# Altium project PROC114E3_SCH.PrjPcb (part 13 of 22)

## Sheet 27.SchDoc
size 513 x 386 mm
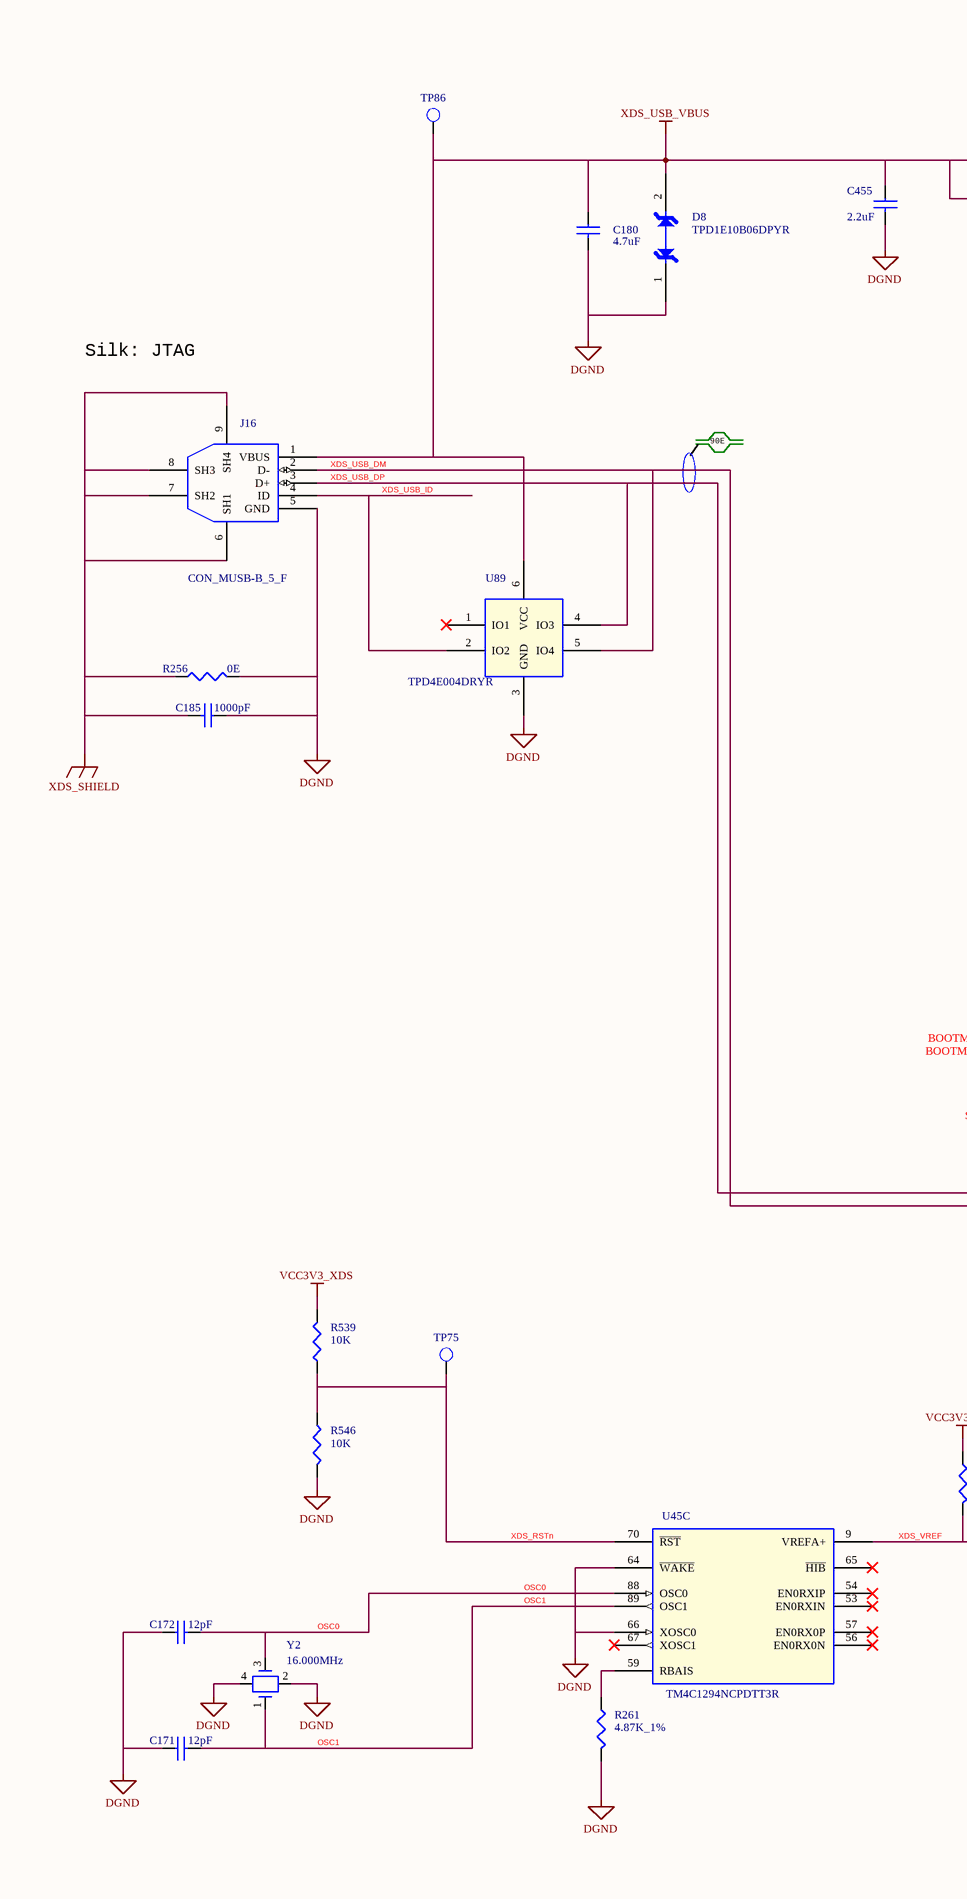
[diagram p43: 27.SchDoc, left]
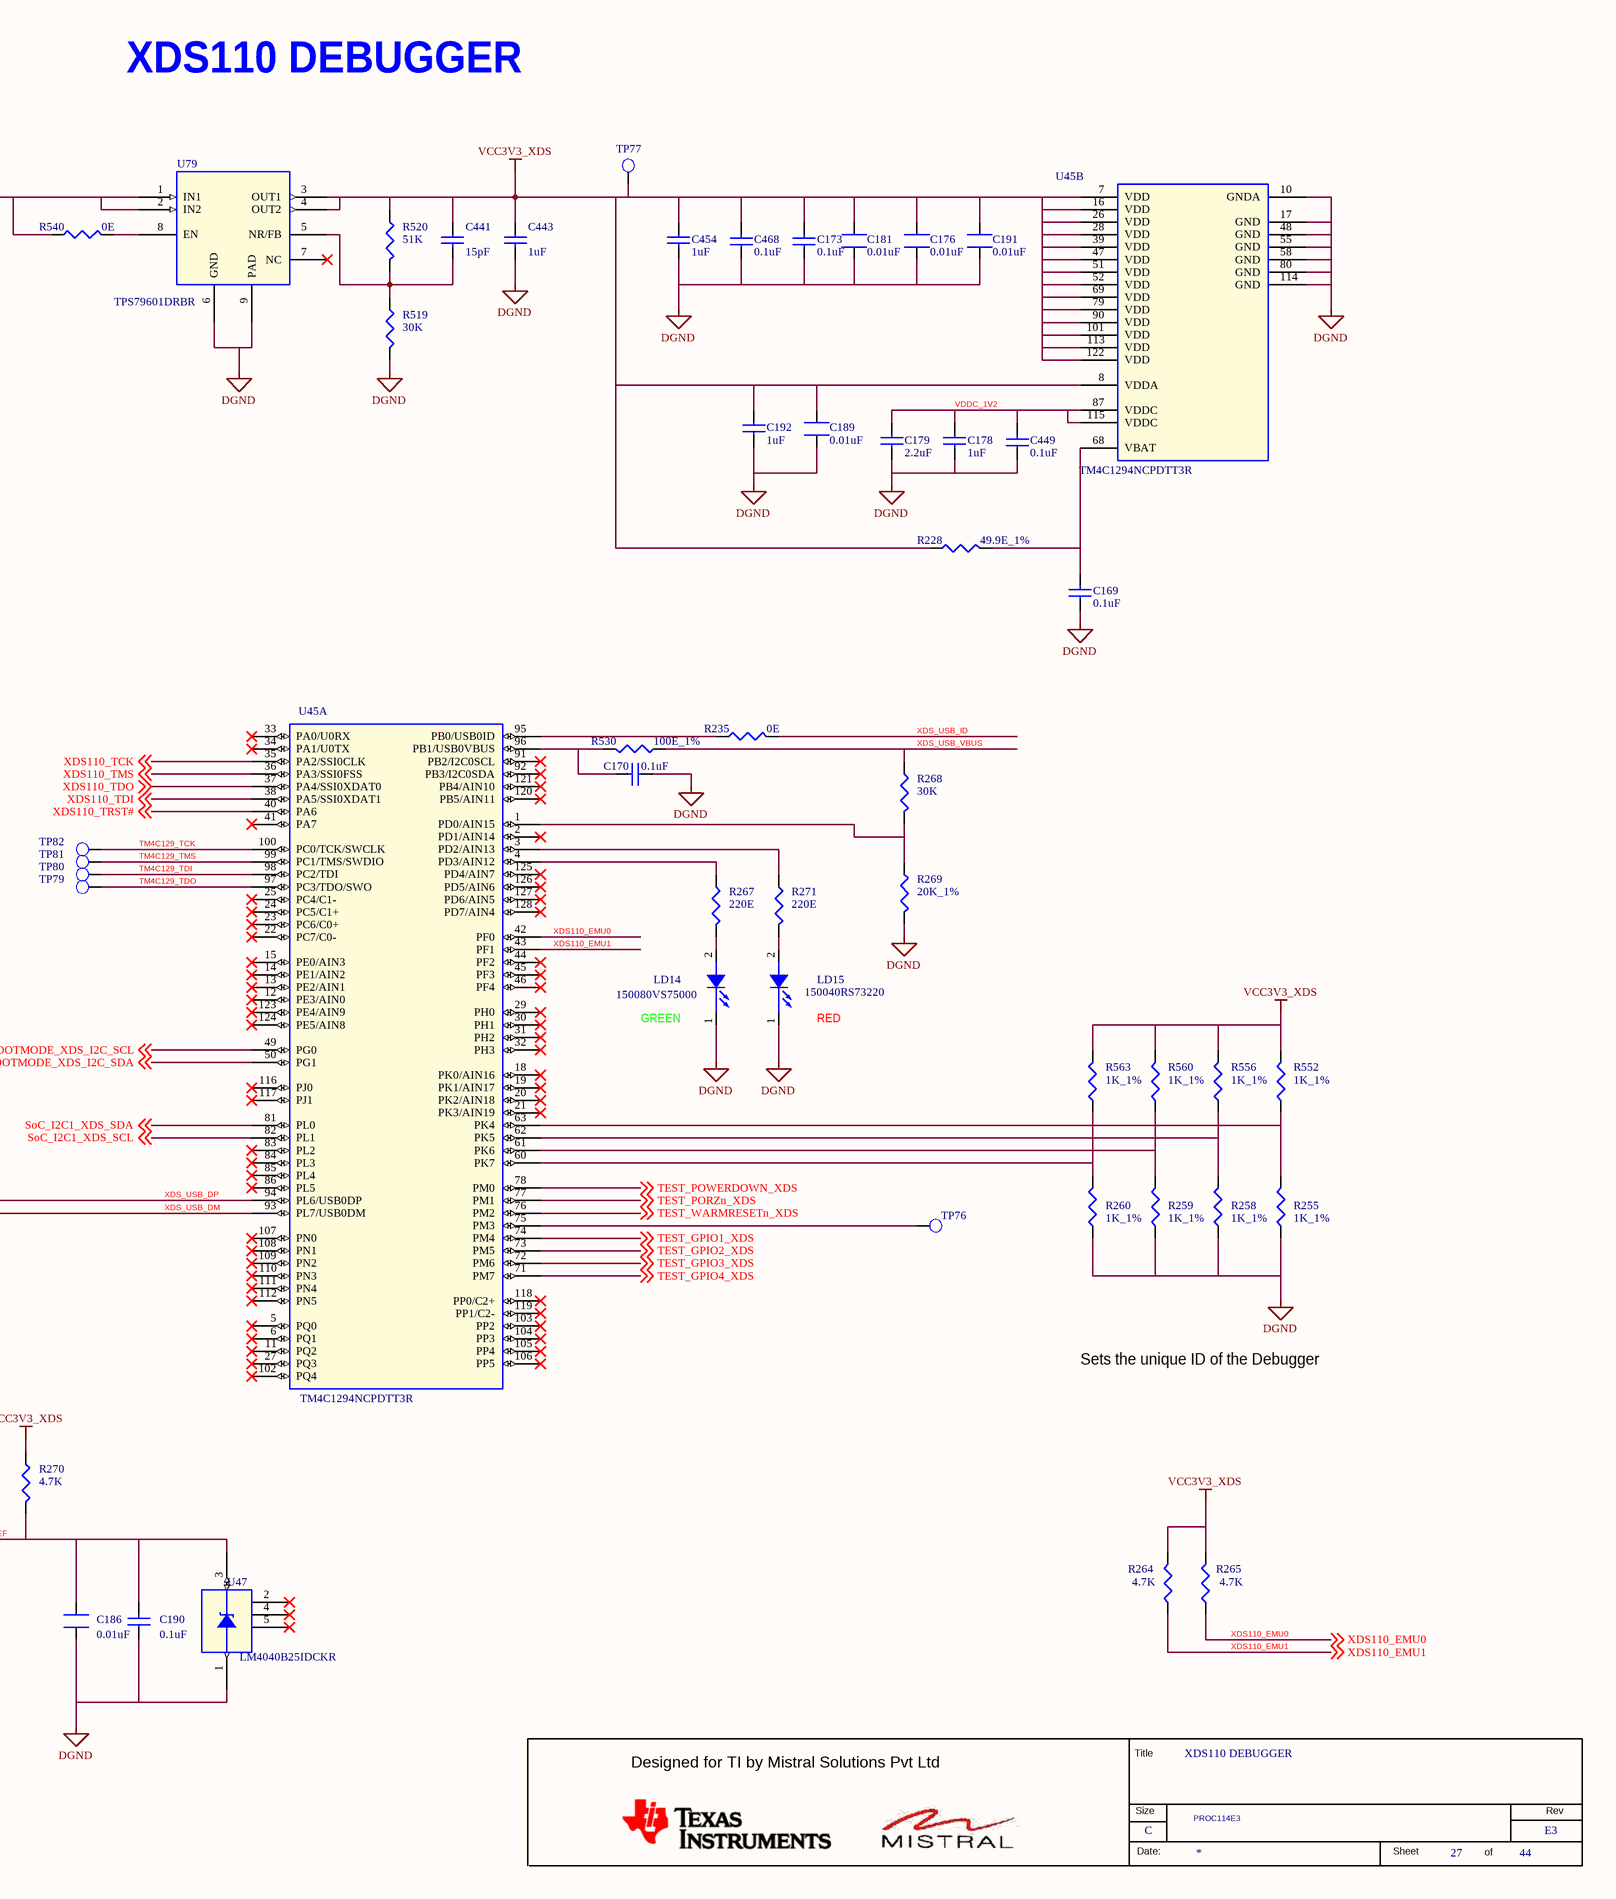
[diagram p44: 27.SchDoc, right]

### Parts
(Parts that share a designator on the sheet are numbered #1, #2 ... from top to bottom, then left to right.)
*#27  RevCode: E3  Title: XDS110 DEBUGGER  Page Size: C  Page Number: 27  Page Count: 44  Variant Name: PROC114E3  (hidden comment: MISTRAL_TITLEBLK_CSIZE)  (graphical)
C169  0.1uF  [CAP0201_0-5]
C170  0.1uF  [CAP0201_0-5]
C171  12pF  [CAP0201_0-5]
C172  12pF  [CAP0201_0-5]
C173  0.1uF  [CAP0201_0-5]
C176  0.01uF  [CAP0402N]
C178  1uF  [CAP0201_0-5]
C179  2.2uF  [CAP0402_0-75]
C180  4.7uF  [CAP0402_0-75]
C181  0.01uF  [CAP0402N]
C185  1000pF  [CAP1206_1-75]
C186  0.01uF  [CAP0402N]
C189  0.01uF  [CAP0402N]
C190  0.1uF  [CAP0201_0-5]
C191  0.01uF  [CAP0402N]
C192  1uF  [CAP0201_0-5]
C441  15pF  [CAP0201_0-5]
C443  1uF  [CAP0201_0-5]
C449  0.1uF  [CAP0201_0-5]
C454  1uF  [CAP0201_0-5]
C455  2.2uF  [CAP0402_0-75]
C468  0.1uF  [CAP0201_0-5]
D8  TPD1E10B06DPYR  [DIO_DFN0402_0-5]
J16  CON_MUSB-B_5_F  [CON_MUSBB5_629105150521_S_R_S_2-7]
LD14  150080VS75000  [LED_150080VS75000_80X50_SMD_0-8]
LD15  150040RS73220  [LED_150040GS73220_40X20_SMD_0-4]
R228  49.9E_1%  [RES0402_0-5]
R235  0E  [RES0402_0-5]
R255  1K_1%  [RES0402_0-5]
R256  0E  [RES0603_0-75]
R258  1K_1%  [RES0402_0-5]
R259  1K_1%  [RES0402_0-5]
R260  1K_1%  [RES0402_0-5]
R261  4.87K_1%  [RES0402]
R264  4.7K  [RES0201_0-5]
R265  4.7K  [RES0201_0-5]
R267  220E  [RES0402_0-5]
R268  30K  [RES0402_0-5]
R269  20K_1%  [RES0402_0-5]
R270  4.7K  [RES0201_0-5]
R271  220E  [RES0402_0-5]
R519  30K  [RES0402_0-5]
R520  51K  [RES0402_0-5]
R530  100E_1%  [RES0402_0-5]
R539  10K  [RES0201_0-5]
R540  0E  [RES0201_0-5]
R546  10K  [RES0201_0-5]
R552  1K_1%  [RES0402_0-5]
R556  1K_1%  [RES0402_0-5]
R560  1K_1%  [RES0402_0-5]
R563  1K_1%  [RES0402_0-5]
TP75  TP20_SMD  [TP20_SMD]  (value not drawn)
TP76  TP20_SMD  [TP20_SMD]  (value not drawn)
TP77  TP20_SMD  [TP20_SMD]  (value not drawn)
TP79  TP20_SMD  [TP20_SMD]  (value not drawn)
TP80  TP20_SMD  [TP20_SMD]  (value not drawn)
TP81  TP20_SMD  [TP20_SMD]  (value not drawn)
TP82  TP20_SMD  [TP20_SMD]  (value not drawn)
TP86  TP20_SMD  [TP20_SMD]  (value not drawn)
U45  TM4C1294NCPDTT3R  [TQFP128_15-74_550X550_1-2]  (parts A,B,C of 3)
U47  LM4040B25IDCKR  [SC70-5_1-1]
U79  TPS79601DRBR  [SON8_25-59_130X130_1]
U89  TPD4E004DRYR  [SON6_19-68_40X60_PB_0-6]
Y2  16.000MHz  [XTAL4_XRCGB-FM_80X60_SMD_0-7]

### Nets
DGND: C169.1 C170.1 C171.1 C172.1 C173.1 C176.2 C178.2 C179.2 C180.2 C181.2 C185.1 C186.2 C189.2 C190.1 C191.2 C192.2 C443.2 C449.1 C454.2 C455.2 C468.1 D8.1 J16.5(GND) LD14.1(CATHODE) LD15.1(CATHODE) R255.1 R256.1 R258.1 R259.1 R260.1 R261.2 R269.2 R519.2 R546.2 U45.10(GNDA) U45.17(GND) U45.48(GND) U45.55(GND) U45.58(GND) U45.64(~{WAKE}) U45.66(XOSC0) U45.80(GND) U45.114(GND) U47.1(ANODE) U79.6(GND) U79.9(PAD) U89.3(GND) Y2.2 Y2.4
VCC3V3_XDS: C173.2 C176.1 C181.1 C189.1 C191.1 C192.1 C441.1 C443.1 C454.1 C468.2 R228.2 R264.1 R265.1 R270.1 R520.1 R539.2 R552.2 R556.2 R560.2 R563.2 TP77.1(TP) U45.7(VDD) U45.8(VDDA) U45.16(VDD) U45.26(VDD) U45.28(VDD) U45.39(VDD) U45.47(VDD) U45.51(VDD) U45.52(VDD) U45.69(VDD) U45.79(VDD) U45.90(VDD) U45.101(VDD) U45.113(VDD) U45.122(VDD) U79.3(OUT1) U79.4(OUT2)
XDS_SHIELD: C185.2 J16.6(SH1) J16.7(SH2) J16.8(SH3) J16.9(SH4) R256.2
XDS_USB_VBUS: C180.1 C455.1 D8.2 J16.1(VBUS) R268.1 R530.1 R540.1 TP86.1(TP) U79.1(IN1) U79.2(IN2) U89.6(VCC)
BOOTMODE_XDS_I2C_SCL: U45.49(PG0) ; off-sheet BOOTMODE_XDS_I2C_SCL
BOOTMODE_XDS_I2C_SDA: U45.50(PG1) ; off-sheet BOOTMODE_XDS_I2C_SDA
OSC0: C172.2 U45.88(OSC0) Y2.3
OSC1: C171.2 U45.89(OSC1) Y2.1
SoC_I2C1_XDS_SCL: U45.82(PL1) ; off-sheet SoC_I2C1_XDS_SCL
SoC_I2C1_XDS_SDA: U45.81(PL0) ; off-sheet SoC_I2C1_XDS_SDA
TEST_GPIO1_XDS: U45.74(PM4) ; off-sheet TEST_GPIO1_XDS
TEST_GPIO2_XDS: U45.73(PM5) ; off-sheet TEST_GPIO2_XDS
TEST_GPIO3_XDS: U45.72(PM6) ; off-sheet TEST_GPIO3_XDS
TEST_GPIO4_XDS: U45.71(PM7) ; off-sheet TEST_GPIO4_XDS
TEST_PORZn_XDS: U45.77(PM1) ; off-sheet TEST_PORZn_XDS
TEST_POWERDOWN_XDS: U45.78(PM0) ; off-sheet TEST_POWERDOWN_XDS
TEST_WARMRESETn_XDS: U45.76(PM2) ; off-sheet TEST_WARMRESETn_XDS
TM4C129_TCK: TP82.1(TP) U45.100(PC0/TCK/SWCLK)
TM4C129_TDI: TP80.1(TP) U45.98(PC2/TDI)
TM4C129_TDO: TP79.1(TP) U45.97(PC3/TDO/SWO)
TM4C129_TMS: TP81.1(TP) U45.99(PC1/TMS/SWDIO)
VDDC_1V2: C178.1 C179.1 C449.2 U45.87(VDDC) U45.115(VDDC)
XDS110_EMU0: R265.2 U45.42(PF0) ; off-sheet XDS110_EMU0
XDS110_EMU1: R264.2 U45.43(PF1) ; off-sheet XDS110_EMU1
XDS110_TCK: U45.35(PA2/SSI0CLK) ; off-sheet XDS110_TCK
XDS110_TDI: U45.38(PA5/SSI0XDAT1) ; off-sheet XDS110_TDI
XDS110_TDO: U45.37(PA4/SSI0XDAT0) ; off-sheet XDS110_TDO
XDS110_TMS: U45.36(PA3/SSI0FSS) ; off-sheet XDS110_TMS
XDS110_TRST#: U45.40(PA6) ; off-sheet XDS110_TRST#
XDS_RSTn: R539.1 R546.1 TP75.1(TP) U45.70(~{RST})
XDS_USB_DM: J16.2(D-) U45.93(PL7/USB0DM) U89.5(IO4)
XDS_USB_DP: J16.3(D+) U45.94(PL6/USB0DP) U89.4(IO3)
XDS_USB_ID: J16.4(ID) R235.2 U89.2(IO2)
XDS_VREF: C186.1 C190.2 R270.2 U45.9(VREFA+) U47.3(CATHODE)
NetC169_2: C169.2 R228.1 U45.68(VBAT)
NetC170_2: C170.2 R530.2 U45.96(PB1/USB0VBUS)
NetC441_2: C441.2 R519.1 R520.2 U79.5(NR/FB)
NetLD14_2: LD14.2(ANODE) R267.2
NetLD15_2: LD15.2(ANODE) R271.2
NetR235_1: R235.1 U45.95(PB0/USB0ID)
NetR255_2: R255.2 R552.1 U45.63(PK4)
NetR258_2: R258.2 R556.1 U45.62(PK5)
NetR259_2: R259.2 R560.1 U45.61(PK6)
NetR260_2: R260.2 R563.1 U45.60(PK7)
NetR261_1: R261.1 U45.59(RBAIS)
NetR267_1: R267.1 U45.4(PD3/AIN12)
NetR268_2: R268.2 R269.1 U45.1(PD0/AIN15)
NetR271_1: R271.1 U45.3(PD2/AIN13)
NetR540_2: R540.2 U79.8(EN)
NetTP76_1: TP76.1(TP) U45.75(PM3)

Not connected (* = marked no-connect by the designer): U45 2(PD1/AIN14)* 5(PQ0)* 6(PQ1)* 11(PQ2)* 12(PE3/AIN0)* 13(PE2/AIN1)* 14(PE1/AIN2)* 15(PE0/AIN3)* 18(PK0/AIN16)* 19(PK1/AIN17)* 20(PK2/AIN18)* 21(PK3/AIN19)* 22(PC7/C0-)* 23(PC6/C0+)* 24(PC5/C1+)* 25(PC4/C1-)* 27(PQ3)* 29(PH0)* 30(PH1)* 31(PH2)* 32(PH3)* 33(PA0/U0RX)* 34(PA1/U0TX)* 41(PA7)* 44(PF2)* 45(PF3)* 46(PF4)* 53(EN0RXIN)* 54(EN0RXIP)* 56(EN0RX0N)* 57(EN0RX0P)* 65(~{HIB})* 67(XOSC1)* 83(PL2)* 84(PL3)* 85(PL4)* 86(PL5)* 91(PB2/I2C0SCL)* 92(PB3/I2C0SDA)* 102(PQ4)* 103(PP2)* 104(PP3)* 105(PP4)* 106(PP5)* 107(PN0)* 108(PN1)* 109(PN2)* 110(PN3)* 111(PN4)* 112(PN5)* 116(PJ0)* 117(PJ1)* 118(PP0/C2+)* 119(PP1/C2-)* 120(PB5/AIN11)* 121(PB4/AIN10)* 123(PE4/AIN9)* 124(PE5/AIN8)* 125(PD4/AIN7)* 126(PD5/AIN6)* 127(PD6/AIN5)* 128(PD7/AIN4)*; U47 2(NC1)* 4(NC2)* 5(NC3)*; U79 7(NC)*; U89 1(IO1)*

### Notes on the sheet
- XDS110 DEBUGGER
- Silk: JTAG
- 90E
- (near LD14) GREEN
- (near LD15) RED
- Sets the unique ID of the Debugger
- (in symbol MISTRAL_TITLEBLK_CSIZE) Title; Designed for TI by Mistral Solutions Pvt Ltd; Size; Rev; Date:; Sheet; of

### Library data of the parts
*#27 = MISTRAL_TITLEBLK_CSIZE: Issue: 1.0; Page Create Date: March  8, 1995; Page Modify Date: *; Schematic Page Count: 44; Schematic Page Number: 27
C169 C170 C173 C190 C449 = CAP_Dup2: as C474 on sheet 25; PCB Footprint: CAP0201_0-5; Footprint Path: Y:\MIS_DATABASE\Library\ALTIUM_TOOL\PCB_FOOTPRINTS\Altium_Footprint_Lib.PcbLib; Library Path: Y:\MIS_DATABASE\Library\ALTIUM_TOOL\SCHEMATICS_PARTS\MS_DISCRETE_Library.schlib; Footprint Ref: CAP0201_0-5; Library Ref: CAP; MECHANICAL 3D STEP FILE: CAP0201_0-5; Chkd/date: MANIRAJA/230118; Crtd /date: MANIRAJA/230118; Datasheet: Y:\MIS_DATABASE\DATASHEETS\CAPACITORS\GRM033R61C104KE14.PDF; Temperature: -55°C+85°C; Weight: 0.33mg; Height: 0.33MM; Distributor_part_number: 490-14305-1-ND; Distributor_name: DIGIKEY; Package: 0201; Voltage: 16V; Tolerance: 10%
C171 = CAP_Dup2: CAP CERAMIC 12pF 25V 5% C0G(NP0) 0201; Part_type: CAPACITORS\CERAMIC; Mfr_part_number: GRM0335C1E120JA01D; Mfr_name: MURATA; Mistral Part No: 120009030213-R; Custom_Duty: 15%; Customs_HS_Code: 85322990; Wattage: NA; Project: QCS610_NANOSOM; PCB Footprint: CAP0201_0-5; Footprint Path: Y:\MIS_DATABASE\Library\ALTIUM_TOOL\PCB_FOOTPRINTS\Altium_Footprint_Lib.PcbLib; Library Path: Y:\MIS_DATABASE\Library\ALTIUM_TOOL\SCHEMATICS_PARTS\MS_DISCRETE_Library.schlib; MECHANICAL 3D STEP FILE: CAP0201_0-5; Chkd/date: MANIRAJA/020620; Crtd /date: ALVY/300520; Datasheet: Y:\MIS_DATABASE\DATASHEETS\CAPACITORS\GRM0335C1E120JA01.PDF; Temperature: -55°C+125°C; Weight: 0.33mg; Height: 0.33MM; Library Ref: CAP; Distributor_part_number: 490-3144-1-ND; Distributor_name: DIGIKEY; Package: 0201; Voltage: 25V; Tolerance: 5%; Footprint Ref: CAP0201_0-5
C172 = CAP_Dup2: CAP CERAMIC 12pF 25V 5% C0G(NP0) 0201; Mistral Part No: 120009030213-R; Mfr_name: MURATA; Mfr_part_number: GRM0335C1E120JA01D; Part_type: CAPACITORS\CERAMIC; Project: QCS610_NANOSOM; Wattage: NA; Customs_HS_Code: 85322990; Custom_Duty: 15%; PCB Footprint: CAP0201_0-5; Footprint Ref: CAP0201_0-5; Tolerance: 5%; Voltage: 25V; Package: 0201; Distributor_name: DIGIKEY; Distributor_part_number: 490-3144-1-ND; Library Ref: CAP; Height: 0.33MM; Weight: 0.33mg; Temperature: -55°C+125°C; Datasheet: Y:\MIS_DATABASE\DATASHEETS\CAPACITORS\GRM0335C1E120JA01.PDF; Crtd /date: ALVY/300520; Chkd/date: MANIRAJA/020620; MECHANICAL 3D STEP FILE: CAP0201_0-5; Library Path: Y:\MIS_DATABASE\Library\ALTIUM_TOOL\SCHEMATICS_PARTS\MS_DISCRETE_Library.schlib; Footprint Path: Y:\MIS_DATABASE\Library\ALTIUM_TOOL\PCB_FOOTPRINTS\Altium_Footprint_Lib.PcbLib
C176 C186 C189 C191 = CAP_Dup3: CAP CERAMIC 0.01uF 25V 10% X5R 0201; Mistral Part No: 120018010007-R; Mfr_name: MURATA; Mfr_part_number: GRM033R61E103KA12J; Part_type: CAPACITORS\CERAMIC; PCB Footprint: CAP0201_0-5; Project: TI_MAXIE_CPB; Customs_HS_Code: 85322990; Custom_Duty: 15%; Wattage: NA; Library Ref: CAP; Tolerance: 10%; Voltage: 25V; Package: 0201; Distributor_name: DIGIKEY; Distributor_part_number: GRM033R61E103KA12J-ND; Height: 0.33MM; Datasheet: Y:\MIS_DATABASE\DATASHEETS\CAPACITORS\GRM033R61E103KA12.PDF; Crtd /date: MANIRAJA/230118; Chkd/date: MANIRAJA/230118; Weight: 0.33mg; Temperature: -55°C+85°C; MECHANICAL 3D STEP FILE: CAP0201_0-5; Footprint Ref: CAP0201_0-5; Library Path: Y:\MIS_DATABASE\Library\ALTIUM_TOOL\SCHEMATICS_PARTS\MS_DISCRETE_Library.schlib; Footprint Path: Y:\MIS_DATABASE\Library\ALTIUM_TOOL\PCB_FOOTPRINTS\Altium_Footprint_Lib.PcbLib
C178 = CAP_Dup2: CAP CERAMIC 1uF 16V 20% X5R 0201; Part_type: CAPACITORS\CERAMIC; Mfr_part_number: GRM033R61C105ME15D; Mfr_name: MURATA; Mistral Part No: 120018090038-R; Custom_Duty: 15%; Customs_HS_Code: 85322990; Project: QCS610_NANOSOM; Wattage: NA; PCB Footprint: CAP0201_0-5; Chkd/date: MANIRAJA/300520; Crtd /date: ALVY/260520; Datasheet: Y:\MIS_DATABASE\DATASHEETS\CAPACITORS\GRM033R61C105ME15.PDF; Temperature: -55°C+85°C; Weight: 0.33mg; Height: 0.39MM; Distributor_part_number: 490-18654-1-ND; Distributor_name: DIGIKEY; Package: 0201; Voltage: 16V; Tolerance: 20%; MECHANICAL 3D STEP FILE: CAP0201_0-5; Library Path: Y:\MIS_DATABASE\Library\ALTIUM_TOOL\SCHEMATICS_PARTS\MS_DISCRETE_Library.schlib; Footprint Path: Y:\MIS_DATABASE\Library\ALTIUM_TOOL\PCB_FOOTPRINTS\Altium_Footprint_Lib.PcbLib; Library Ref: CAP; Footprint Ref: CAP0201_0-5
C179 = CAP_Dup2: CAP CERAMIC 2.2uF 25V 10% X5R 0402; Part_type: CAPACITORS\CERAMIC; Mfr_part_number: GRM155R61E225KE11D; Mfr_name: MURATA; Mistral Part No: 120015120001-R; Custom_Duty: 15%; Customs_HS_Code: 85322990; Wattage: NA; Project: TI_AM263X_CC; PCB Footprint: CAP0402_0-75; Library Ref: CAP; MECHANICAL 3D STEP FILE: CAP0402_0-75; Chkd/date: ALVY/010721; Crtd /date: MANIRAJA/010721; Datasheet: Y:\MIS_DATABASE\DATASHEETS\CAPACITORS\GRM155R61E225KE11.PDF; Temperature: -55°C+85°C; Weight: 1.5mg; Height: 0.70MM; Distributor_part_number: 490-12703-1-ND; Distributor_name: DIGIKEY; Package: 0402; Voltage: 25V; Tolerance: 10%; Footprint Ref: CAP0402_0-75; Library Path: Y:\MIS_DATABASE\Library\ALTIUM_TOOL\SCHEMATICS_PARTS\MS_DISCRETE_Library.schlib; Footprint Path: Y:\MIS_DATABASE\Library\ALTIUM_TOOL\PCB_FOOTPRINTS\Altium_Footprint_Lib.PcbLib
C180 = CAP_Dup2: CAP CERAMIC 4.7uF 10V 20% X5R 0402; Part_type: CAPACITORS\CERAMIC; Mfr_part_number: GRM155R61A475MEAAD; Mfr_name: MURATA; Mistral Part No: 120012060002-R; Custom_Duty: 15%; Customs_HS_Code: 85322990; Wattage: NA; Project: TI_J7SVB_PCIE_ADD-ON-CARD; PCB Footprint: CAP0402_0-75; Footprint Path: Y:\MIS_DATABASE\Library\ALTIUM_TOOL\PCB_FOOTPRINTS\Altium_Footprint_Lib.PcbLib; Library Path: Y:\MIS_DATABASE\Library\ALTIUM_TOOL\SCHEMATICS_PARTS\MS_DISCRETE_Library.schlib; MECHANICAL 3D STEP FILE: CAP0402_0-75; Chkd/date: MANIRAJA/110718; Crtd /date: ALVY/110718; Datasheet: Y:\MIS_DATABASE\DATASHEETS\CAPACITORS\GRM155R61A475MEAAD.PDF; Temperature: -55°C+85°C; Weight: 14mg; Height: 0.65MM; Library Ref: CAP; Distributor_part_number: 490-14306-1-ND; Distributor_name: DIGIKEY; Package: 0402; Voltage: 10V; Tolerance: 20%; Footprint Ref: CAP0402_0-75
C181 = CAP_Dup3: as C442 on sheet 26; Footprint Path: Y:\MIS_DATABASE\Library\ALTIUM_TOOL\PCB_FOOTPRINTS\Altium_Footprint_Lib.PcbLib; Library Path: Y:\MIS_DATABASE\Library\ALTIUM_TOOL\SCHEMATICS_PARTS\MS_DISCRETE_Library.schlib; Footprint Ref: CAP0201_0-5; MECHANICAL 3D STEP FILE: CAP0201_0-5; Temperature: -55°C+85°C; Weight: 0.33mg; Chkd/date: MANIRAJA/230118; Crtd /date: MANIRAJA/230118; Datasheet: Y:\MIS_DATABASE\DATASHEETS\CAPACITORS\GRM033R61E103KA12.PDF; Height: 0.33MM; Distributor_part_number: GRM033R61E103KA12J-ND; Distributor_name: DIGIKEY; Package: 0201; Voltage: 25V; Tolerance: 10%; Library Ref: CAP
C185 = CAP_Dup2: CAP CERAMIC 1000pF 2KV 10% X7R 1206; Mistral Part No: 120015080006-R; Mfr_name: AVX CORPORATION; Mfr_part_number: 1206GC102KAT1A; Part_type: CAPACITORS\CERAMIC; Project: ADR1B; Customs_HS_Code: 85322990; Custom_Duty: 15%; Wattage: NA; PCB Footprint: CAP1206_1-75; Footprint Path: Y:\MIS_DATABASE\Library\ALTIUM_TOOL\PCB_FOOTPRINTS\Altium_Footprint_Lib.PcbLib; Library Path: Y:\MIS_DATABASE\Library\ALTIUM_TOOL\SCHEMATICS_PARTS\MS_DISCRETE_Library.schlib; Footprint Ref: CAP1206_1-75; Library Ref: CAP; Tolerance: 10%; Voltage: 2KV; Package: 1206; Distributor_name: DIGIKEY; Distributor_part_number: 478-2956-1-ND; Height: 1.52MM; Datasheet: Y:\MIS_DATABASE\DATASHEETS\CAPACITORS\AVX_HV-MLC.PDF; Crtd /date: MAZHAR/281106; Chkd/date: SHREESHAIL/291106; Weight: 16.2mg; Temperature: -55°C+125°C; MECHANICAL 3D STEP FILE: CAP1206_1-75
C192 C454 = CAP_Dup2: CAP CERAMIC 1uF 16V 20% X5R 0201; Part_type: CAPACITORS\CERAMIC; Mfr_part_number: GRM033R61C105ME15D; Mfr_name: MURATA; Mistral Part No: 120018090038-R; Wattage: NA; Custom_Duty: 15%; Customs_HS_Code: 85322990; Project: QCS610_NANOSOM; PCB Footprint: CAP0201_0-5; Footprint Ref: CAP0201_0-5; Library Ref: CAP; Footprint Path: Y:\MIS_DATABASE\Library\ALTIUM_TOOL\PCB_FOOTPRINTS\Altium_Footprint_Lib.PcbLib; Library Path: Y:\MIS_DATABASE\Library\ALTIUM_TOOL\SCHEMATICS_PARTS\MS_DISCRETE_Library.schlib; MECHANICAL 3D STEP FILE: CAP0201_0-5; Chkd/date: MANIRAJA/300520; Crtd /date: ALVY/260520; Datasheet: Y:\MIS_DATABASE\DATASHEETS\CAPACITORS\GRM033R61C105ME15.PDF; Temperature: -55°C+85°C; Weight: 0.33mg; Height: 0.39MM; Distributor_part_number: 490-18654-1-ND; Distributor_name: DIGIKEY; Package: 0201; Voltage: 16V; Tolerance: 20%
C441 = CAP_Dup2: CAP CERAMIC 15pF 25V 2% HI-Q C0G(NP0) 0201; Part_type: CAPACITORS\CERAMIC; Mfr_part_number: GJM0335C1E150GB01D; Mfr_name: MURATA; Mistral Part No: 120016120011-R; Custom_Duty: 15%; Customs_HS_Code: 85322990; Wattage: NA; Project: OCTBTS5200; PCB Footprint: CAP0201_0-5; Library Ref: CAP; MECHANICAL 3D STEP FILE: CAP0201_0-5; Chkd/date: VASANTHA/081216; Crtd /date: MANIRAJA/081216; Datasheet: Y:\MIS_DATABASE\DATASHEETS\CAPACITORS\MURATA-GXX-SER_NOV17.PDF; Temperature: -55°C+125°C; Weight: 0.33mg; Height: 0.33MM; Distributor_part_number: 490-10562-1-ND; Distributor_name: DIGIKEY; Package: 0201; Voltage: 25V; Tolerance: 2%; Footprint Ref: CAP0201_0-5; Library Path: Y:\MIS_DATABASE\Library\ALTIUM_TOOL\SCHEMATICS_PARTS\MS_DISCRETE_Library.schlib; Footprint Path: Y:\MIS_DATABASE\Library\ALTIUM_TOOL\PCB_FOOTPRINTS\Altium_Footprint_Lib.PcbLib
C443 = CAP_Dup2: CAP CERAMIC 1uF 16V 20% X5R 0201; Mistral Part No: 120018090038-R; Mfr_name: MURATA; Mfr_part_number: GRM033R61C105ME15D; Part_type: CAPACITORS\CERAMIC; Wattage: NA; Project: QCS610_NANOSOM; Customs_HS_Code: 85322990; Custom_Duty: 15%; PCB Footprint: CAP0201_0-5; Footprint Ref: CAP0201_0-5; Library Ref: CAP; Footprint Path: Y:\MIS_DATABASE\Library\ALTIUM_TOOL\PCB_FOOTPRINTS\Altium_Footprint_Lib.PcbLib; Library Path: Y:\MIS_DATABASE\Library\ALTIUM_TOOL\SCHEMATICS_PARTS\MS_DISCRETE_Library.schlib; MECHANICAL 3D STEP FILE: CAP0201_0-5; Tolerance: 20%; Voltage: 16V; Package: 0201; Distributor_name: DIGIKEY; Distributor_part_number: 490-18654-1-ND; Height: 0.39MM; Weight: 0.33mg; Temperature: -55°C+85°C; Datasheet: Y:\MIS_DATABASE\DATASHEETS\CAPACITORS\GRM033R61C105ME15.PDF; Crtd /date: ALVY/260520; Chkd/date: MANIRAJA/300520
C455 = CAP_Dup2: CAP CERAMIC 2.2uF 25V 10% X5R 0402; Mistral Part No: 120015120001-R; Mfr_name: MURATA; Mfr_part_number: GRM155R61E225KE11D; Part_type: CAPACITORS\CERAMIC; Project: TI_AM263X_CC; Wattage: NA; Customs_HS_Code: 85322990; Custom_Duty: 15%; PCB Footprint: CAP0402_0-75; Footprint Path: Y:\MIS_DATABASE\Library\ALTIUM_TOOL\PCB_FOOTPRINTS\Altium_Footprint_Lib.PcbLib; Library Path: Y:\MIS_DATABASE\Library\ALTIUM_TOOL\SCHEMATICS_PARTS\MS_DISCRETE_Library.schlib; Footprint Ref: CAP0402_0-75; Tolerance: 10%; Voltage: 25V; Package: 0402; Distributor_name: DIGIKEY; Distributor_part_number: 490-12703-1-ND; Height: 0.70MM; Weight: 1.5mg; Temperature: -55°C+85°C; Datasheet: Y:\MIS_DATABASE\DATASHEETS\CAPACITORS\GRM155R61E225KE11.PDF; Crtd /date: MANIRAJA/010721; Chkd/date: ALVY/010721; MECHANICAL 3D STEP FILE: CAP0402_0-75; Library Ref: CAP
C468 = CAP_Dup2: as C325 on sheet 24; PCB Footprint: CAP0201_0-5; Tolerance: 10%; Voltage: 16V; Package: 0201; Distributor_name: DIGIKEY; Distributor_part_number: 490-14305-1-ND; Height: 0.33MM; Weight: 0.33mg; Temperature: -55°C+85°C; Datasheet: Y:\MIS_DATABASE\DATASHEETS\CAPACITORS\GRM033R61C104KE14.PDF; Crtd /date: MANIRAJA/230118; Chkd/date: MANIRAJA/230118; MECHANICAL 3D STEP FILE: CAP0201_0-5; Library Ref: CAP; Footprint Ref: CAP0201_0-5; Library Path: Y:\MIS_DATABASE\Library\ALTIUM_TOOL\SCHEMATICS_PARTS\MS_DISCRETE_Library.schlib; Footprint Path: Y:\MIS_DATABASE\Library\ALTIUM_TOOL\PCB_FOOTPRINTS\Altium_Footprint_Lib.PcbLib
D8 = DIODE_SOD323: DIODE 1CH ESD PROTECTION X1SON2; Mfr_name: TEXAS INSTRUMENTS; Mistral Part No: 130014110022-R; Custom_Duty: 15%; Customs_HS_Code: 85423100; Wattage: NA; Project: GALILEO_EVM; PCB Footprint: DIO_DFN0402_0-5; Footprint Path: Y:\MIS_DATABASE\Library\ALTIUM_TOOL\PCB_FOOTPRINTS\Altium_Footprint_Lib.PcbLib; Library Path: Y:\MIS_DATABASE\Library\ALTIUM_TOOL\SCHEMATICS_PARTS\MS_DISCRETE_Library.schlib; MECHANICAL 3D STEP FILE: DIO_DFN0402_0-5; Chkd/date: MANIRAJA/040420; Crtd /date: VASANTHA/181114; Datasheet: Y:\MIS_DATABASE\DATASHEETS\ICS\INTERFACE\TPD1E10B06-SER.PDF; Temperature: -40°C+125°C; Weight: 1mg; Height: 0.45MM; Library Ref: DIODE_SOD323; Distributor_part_number: 296-30406-1-ND; Distributor_name: DIGIKEY; Package: X1SON2; Voltage: NA; Tolerance: NA; Part_type: DIODE; Mfr_part_number: TPD1E10B06DPYR; Footprint Ref: DIO_DFN0402_0-5
J16 = CON_USB_MINI-B: CON MICRO USB TYPE B 5POS FEMALE RT SMD; Mistral Part No: 150019050015-R; Mfr_name: WURTH ELECTRONICS; Mfr_part_number: 629105150521; Part_type: CONNECTOR\USB; Project: NEXTNAV_ALT-STATION_ATE_BRD; Tolerance: NA; Customs_HS_Code: 85369090; Custom_Duty: 24%; PCB Footprint: CON_MUSBB5_629105150521_S_R_S_2-7; Voltage: NA; Wattage: NA; Package: SMD; Distributor_name: DIGIKEY; Distributor_part_number: 732-5960-1-ND; Library Ref: CON_USB_MINI-B; Footprint Ref: CON_MUSBB5_629105150521_S_R_S_2-7; Height: 2.66MM; Weight: 360mg; Temperature: -40°C+85°C; Datasheet: Y:\MIS_DATABASE\DATASHEETS\CONNECTORS\629105150521.PDF; Crtd /date: ALVY/150519; Chkd/date: MANIRAJA/150519; MECHANICAL 3D STEP FILE: CON_MUSBB5_629105150521_S_R_S_2-7; Library Path: Y:\MIS_DATABASE\Library\ALTIUM_TOOL\SCHEMATICS_PARTS\MS_CONNECTOR_Library.schlib; Footprint Path: Y:\MIS_DATABASE\Library\ALTIUM_TOOL\PCB_FOOTPRINTS\Altium_Footprint_Lib.PcbLib
LD14 = DIODE_LED: DIODE LED BRIGHT GREEN SMD; Part_type: OPTO\LED; Mfr_name: WURTH ELECTRONICS; Mistral Part No: 130020080012-R; Custom_Duty: 24%; Customs_HS_Code: 85439000; Wattage: NA; Project: AM64x_EVM_BRD; PCB Footprint: LED_150080VS75000_80X50_SMD_0-8; Footprint Path: Y:\MIS_DATABASE\Library\ALTIUM_TOOL\PCB_FOOTPRINTS\Altium_Footprint_Lib.PcbLib; Library Path: Y:\MIS_DATABASE\Library\ALTIUM_TOOL\SCHEMATICS_PARTS\MS_OPTO_Library.schlib; MECHANICAL 3D STEP FILE: LED_150080VS75000_80X50_SMD_0-8; Chkd/date: MANIRAJA/180820; Crtd /date: ALVY/180820; Datasheet: Y:\MIS_DATABASE\DATASHEETS\DISCRETES\LEDS\150080VS75000.PDF; Temperature: -40°C+85°C; Weight: 10mg; Height: 0.80MM; Library Ref: DIODE_LED; Distributor_part_number: 732-4986-1-ND; Distributor_name: DIGIKEY; Package: SMD; Voltage: NA; Tolerance: NA; Mfr_part_number: 150080VS75000; Footprint Ref: LED_150080VS75000_80X50_SMD_0-8
LD15 = DIODE_LED: as LD8 on sheet 24; PCB Footprint: LED_150040GS73220_40X20_SMD_0-4; MECHANICAL 3D STEP FILE: LED_150040GS73220_40X20_SMD_0-4; Chkd/date: MANIRAJA/100920; Crtd /date: ALVY/100920; Datasheet: Y:\MIS_DATABASE\DATASHEETS\DISCRETES\LEDS\150040RS73220.PDF; Temperature: -40°C+85°C; Weight: 29.3mg; Height: 0.35MM; Distributor_part_number: 732-13422-1-ND; Distributor_name: DIGIKEY; Package: SMD; Voltage: NA; Tolerance: NA; Mfr_part_number: 150040RS73220; Library Path: Y:\MIS_DATABASE\Library\ALTIUM_TOOL\SCHEMATICS_PARTS\MS_OPTO_Library.schlib; Footprint Path: Y:\MIS_DATABASE\Library\ALTIUM_TOOL\PCB_FOOTPRINTS\Altium_Footprint_Lib.PcbLib; Library Ref: DIODE_LED; Footprint Ref: LED_150040GS73220_40X20_SMD_0-4
R228 = RESISTOR_Dup6: RES 49.9E 1/16W 1% 0402; Part_type: RESISTORS\FIXED; Mfr_part_number: CRCW040249R9FKEDC; Mfr_name: VISHAY; Mistral Part No: 110009030846-R; Voltage: NA; Custom_Duty: 15%; Customs_HS_Code: 85332119; Project: RFSU_RFTJ_CARD; PCB Footprint: RES0402_0-5; Footprint Path: Y:\MIS_DATABASE\Library\ALTIUM_TOOL\PCB_FOOTPRINTS\Altium_Footprint_Lib.PcbLib; Library Path: Y:\MIS_DATABASE\Library\ALTIUM_TOOL\SCHEMATICS_PARTS\MS_DISCRETE_Library.schlib; MECHANICAL 3D STEP FILE: RES0402_0-5; Temperature: -55°C+155°C; Weight: 0.65mg; Footprint Ref: RES0402_0-5; Chkd/date: MANIRAJA/210519; Crtd /date: MANIRAJA/210519; Datasheet: Y:\MIS_DATABASE\DATASHEETS\RESISTORS\CRCW_C-SER.PDF; Height: 0.35MM; Distributor_part_number: 541-3967-1-ND; Distributor_name: DIGIKEY; Package: 0402; Wattage: 1/16W; Tolerance: 1%; Library Ref: RESISTOR
R235 = RESISTOR_Dup4: RES 0E 1/16W JUMPER 0402; Mistral Part No: 110010080019-R; Mfr_name: VISHAY; Mfr_part_number: CRCW04020000Z0ED; Part_type: RESISTORS\FIXED; Project: PB_BUGBASE; Tolerance: NA; Customs_HS_Code: 85332119; Custom_Duty: 15%; PCB Footprint: RES0402_0-5; Footprint Path: Y:\MIS_DATABASE\Library\ALTIUM_TOOL\PCB_FOOTPRINTS\Altium_Footprint_Lib.PcbLib; Library Path: Y:\MIS_DATABASE\Library\ALTIUM_TOOL\SCHEMATICS_PARTS\MS_DISCRETE_Library.schlib; Footprint Ref: RES0402_0-5; Library Ref: RESISTOR; Voltage: NA; Wattage: 1/16W; Package: 0402; Distributor_name: DIGIKEY; Distributor_part_number: 541-0.0JCT-ND; Height: 0.40MM; Weight: 0.65mg; Temperature: -55°C+155°C; Datasheet: Y:\MIS_DATABASE\DATASHEETS\RESISTORS\CRCW0603.PDF; Crtd /date: MUDDU/190810; Chkd/date: VASANTHA/201216; MECHANICAL 3D STEP FILE: RES0402_0-5
R255 R258-R260 R552 R560 R563 = RESISTOR_Dup4: RES 1K 1/10W 1% 0402; Mistral Part No: 110009030411-R; Mfr_name: PANASONIC-ECG; Mfr_part_number: ERJ-2RKF1001X; Part_type: RESISTORS\FIXED; Project: VOCERA; Voltage: NA; Customs_HS_Code: 85332119; Custom_Duty: 15%; PCB Footprint: RES0402_0-5; Footprint Path: Y:\MIS_DATABASE\Library\ALTIUM_TOOL\PCB_FOOTPRINTS\Altium_Footprint_Lib.PcbLib; Library Path: Y:\MIS_DATABASE\Library\ALTIUM_TOOL\SCHEMATICS_PARTS\MS_DISCRETE_Library.schlib; MECHANICAL 3D STEP FILE: RES0402_0-5; Footprint Ref: RES0402_0-5; Library Ref: RESISTOR; Tolerance: 1%; Wattage: 1/10W; Package: 0402; Distributor_name: DIGIKEY; Distributor_part_number: P1.00KLCT-ND; Height: 0.40MM; Weight: 0.8mg; Temperature: -55°C+155°C; Datasheet: Y:\MIS_DATABASE\DATASHEETS\RESISTORS\PAN-ERJSER_NOV17.PDF; Crtd /date: MAZHAR/150506; Chkd/date: VASANTHA/281216
R256 = RESISTOR_Dup6: RES 0E 1/10W 5% 0603; Manufacturer: YAGEO AMERICA; Part_type: RESISTORS\FIXED; Mfr_part_number: RC0603JR-070RL; Mfr_name: PANASONIC-ECG; Mistral Part No: 110011020013-R; Custom_Duty: 15%; Customs_HS_Code: 85332119; Voltage: NA; Project: KENNEL; PCB Footprint: RES0603_0-75; Library Ref: RESISTOR; Chkd/date: MANIRAJA/051217; Crtd /date: BAVISH/180211; Datasheet: Y:\MIS_DATABASE\DATASHEETS\RESISTORS\RCXXXXL-SER_MAR18.PDF; Temperature: -55°C+155°C; Weight: 2mg; Height: 0.55MM; Distributor_part_number: 311-0.0GRCT-ND; Distributor_name: DIGIKEY; Package: 0603; Wattage: 1/10W; Tolerance: 5%; MECHANICAL 3D STEP FILE: RES0603_0-75; Footprint Ref: RES0603_0-75; Library Path: Y:\MIS_DATABASE\Library\ALTIUM_TOOL\SCHEMATICS_PARTS\MS_DISCRETE_Library.schlib; Footprint Path: Y:\MIS_DATABASE\Library\ALTIUM_TOOL\PCB_FOOTPRINTS\Altium_Footprint_Lib.PcbLib
R261 = RESISTOR_Dup6: RES 4.87K 1/16W 1% 0402; Part_type: RESISTORS\FIXED; Mfr_part_number: ERJ2RKF4871X; Mfr_name: PANASONIC-ECG; Mistral Part No: 110009030803-R; Voltage: NA; Custom_Duty: 15%; Customs_HS_Code: 85332119; Project: BSN-II; PCB Footprint: RES0402; Footprint Path: Y:\MIS_DATABASE\Library\ALTIUM_TOOL\PCB_FOOTPRINTS\Altium_Footprint_Lib.PcbLib; Library Path: Y:\MIS_DATABASE\Library\ALTIUM_TOOL\SCHEMATICS_PARTS\MS_DISCRETE_Library.schlib; Temperature: -55°C+155°C; Weight: 0.8mg; Footprint Ref: RES0402; Library Ref: RESISTOR; Chkd/date: MAZHAR/150709; Crtd /date: USMAN/150109; Datasheet: Y:\MIS_DATABASE\DATASHEETS\RESISTORS\PAN-ERJSERIES.PDF; Height: 0.40MM; Distributor_part_number: P4.87KLCT-ND; Distributor_name: DIGIKEY; Package: 0402; Wattage: 1/16W; Tolerance: 1%
R264 R265 R270 = RESISTOR_Dup6: as R600 on sheet 25; PCB Footprint: RES0201_0-5; Footprint Ref: RES0201_0-5; Tolerance: 5%; Wattage: 1/20W; Package: 0201; Distributor_name: DIGIKEY; Distributor_part_number: 311-4.7KNCT-ND; Library Ref: RESISTOR; Height: 0.26MM; Weight: 0.17mg; Temperature: -55°C+125°C; Datasheet: Y:\MIS_DATABASE\DATASHEETS\RESISTORS\RCXXXXL-SER_MAR18.PDF; Crtd /date: ALVY/200921; Chkd/date: MANIRAJA/200921; MECHANICAL 3D STEP FILE: RES0201_0-5; Library Path: Y:\MIS_DATABASE\Library\ALTIUM_TOOL\SCHEMATICS_PARTS\MS_DISCRETE_Library.schlib; Footprint Path: Y:\MIS_DATABASE\Library\ALTIUM_TOOL\PCB_FOOTPRINTS\Altium_Footprint_Lib.PcbLib
R267 = RESISTOR_Dup6: RES 220E 1/10W 5% 0402; Part_type: RESISTORS\FIXED; Mfr_part_number: ERJ-2GEJ221X; Mfr_name: PANASONIC-ECG; Mistral Part No: 110009030506-R; Voltage: NA; Custom_Duty: 15%; Customs_HS_Code: 85332119; Project: RED EYE; PCB Footprint: RES0402_0-5; Footprint Path: Y:\MIS_DATABASE\Library\ALTIUM_TOOL\PCB_FOOTPRINTS\Altium_Footprint_Lib.PcbLib; Library Path: Y:\MIS_DATABASE\Library\ALTIUM_TOOL\SCHEMATICS_PARTS\MS_DISCRETE_Library.schlib; MECHANICAL 3D STEP FILE: RES0402_0-5; Temperature: -55°C+155°C; Weight: 0.8mg; Chkd/date: VASANTHA/291216; Crtd /date: GEETHA/260406; Datasheet: Y:\MIS_DATABASE\DATASHEETS\RESISTORS\PAN-ERJSER_NOV17.PDF; Height: 0.40MM; Distributor_part_number: P220JCT-ND; Distributor_name: DIGIKEY; Package: 0402; Wattage: 1/10W; Tolerance: 5%; Library Ref: RESISTOR; Footprint Ref: RES0402_0-5
R268 R519 = RESISTOR_Dup6: RES 30K 1/16W 5% 0402; Part_type: RESISTORS\FIXED; Mfr_part_number: CRCW040230K0JNED; Mfr_name: VISHAY; Mistral Part No: 110017080023-R; Custom_Duty: 15%; Customs_HS_Code: 85332119; Voltage: NA; Project: TI_MAXIE_CPB; PCB Footprint: RES0402_0-5; MECHANICAL 3D STEP FILE: RES0402_0-5; Chkd/date: MANIRAJA/230817; Crtd /date: MANIRAJA/230817; Datasheet: Y:\MIS_DATABASE\DATASHEETS\RESISTORS\CRCW0603.PDF; Temperature: -55°C+155°C; Weight: 0.65mg; Height: 0.40MM; Distributor_part_number: 541-30KJCT-ND; Distributor_name: DIGIKEY; Package: 0402; Wattage: 1/16W; Tolerance: 5%; Library Ref: RESISTOR; Footprint Ref: RES0402_0-5; Library Path: Y:\MIS_DATABASE\Library\ALTIUM_TOOL\SCHEMATICS_PARTS\MS_DISCRETE_Library.schlib; Footprint Path: Y:\MIS_DATABASE\Library\ALTIUM_TOOL\PCB_FOOTPRINTS\Altium_Footprint_Lib.PcbLib
R269 = RESISTOR_Dup6: RES 20K 1/16W 1% 0402; Part_type: RESISTORS\FIXED; Mfr_part_number: CRCW040220K0FKED; Mfr_name: VISHAY; Mistral Part No: 110009030486-R; Custom_Duty: 15%; Customs_HS_Code: 85332119; Voltage: NA; Project: VAGG_SBC_BRD; PCB Footprint: RES0402_0-5; MECHANICAL 3D STEP FILE: RES0402_0-5; Chkd/date: MANIRAJA/021120; Crtd /date: MANIRAJA/021120; Datasheet: Y:\MIS_DATABASE\DATASHEETS\RESISTORS\CRCW0603.PDF; Temperature: -55°C+155°C; Weight: 0.65mg; Height: 0.40MM; Distributor_part_number: 541-20.0KLCT-ND; Distributor_name: DIGIKEY; Package: 0402; Wattage: 1/16W; Tolerance: 1%; Library Ref: RESISTOR; Footprint Ref: RES0402_0-5; Library Path: Y:\MIS_DATABASE\Library\ALTIUM_TOOL\SCHEMATICS_PARTS\MS_DISCRETE_Library.schlib; Footprint Path: Y:\MIS_DATABASE\Library\ALTIUM_TOOL\PCB_FOOTPRINTS\Altium_Footprint_Lib.PcbLib
R271 = RESISTOR_Dup6: RES 220E 1/10W 5% 0402; Mistral Part No: 110009030506-R; Mfr_name: PANASONIC-ECG; Mfr_part_number: ERJ-2GEJ221X; Part_type: RESISTORS\FIXED; Project: RED EYE; Customs_HS_Code: 85332119; Custom_Duty: 15%; Voltage: NA; PCB Footprint: RES0402_0-5; MECHANICAL 3D STEP FILE: RES0402_0-5; Tolerance: 5%; Wattage: 1/10W; Package: 0402; Distributor_name: DIGIKEY; Distributor_part_number: P220JCT-ND; Height: 0.40MM; Datasheet: Y:\MIS_DATABASE\DATASHEETS\RESISTORS\PAN-ERJSER_NOV17.PDF; Crtd /date: GEETHA/260406; Chkd/date: VASANTHA/291216; Library Ref: RESISTOR; Footprint Ref: RES0402_0-5; Weight: 0.8mg; Temperature: -55°C+155°C; Library Path: Y:\MIS_DATABASE\Library\ALTIUM_TOOL\SCHEMATICS_PARTS\MS_DISCRETE_Library.schlib; Footprint Path: Y:\MIS_DATABASE\Library\ALTIUM_TOOL\PCB_FOOTPRINTS\Altium_Footprint_Lib.PcbLib
R520 = RESISTOR_Dup6: RES 51K 1/16W 5% 0402; Part_type: RESISTORS\FIXED; Mfr_part_number: CRCW040251K0JNED; Mfr_name: VISHAY; Mistral Part No: 110009030966-R; Custom_Duty: 15%; Customs_HS_Code: 85332119; Voltage: NA; Project: TI_MAXIE_CPB; PCB Footprint: RES0402_0-5; Library Ref: RESISTOR; MECHANICAL 3D STEP FILE: RES0402_0-5; Chkd/date: MANIRAJA/230817; Crtd /date: MANIRAJA/230817; Datasheet: Y:\MIS_DATABASE\DATASHEETS\RESISTORS\CRCW0603.PDF; Temperature: -55°C+155°C; Weight: 0.65mg; Height: 0.40MM; Distributor_part_number: 541-51KJCT-ND; Distributor_name: DIGIKEY; Package: 0402; Wattage: 1/16W; Tolerance: 5%; Footprint Ref: RES0402_0-5; Library Path: Y:\MIS_DATABASE\Library\ALTIUM_TOOL\SCHEMATICS_PARTS\MS_DISCRETE_Library.schlib; Footprint Path: Y:\MIS_DATABASE\Library\ALTIUM_TOOL\PCB_FOOTPRINTS\Altium_Footprint_Lib.PcbLib
R530 = RESISTOR_Dup6: RES 100E 1/16W 1% 0402; Mistral Part No: 110014070015-R; Mfr_name: YAGEO AMERICA; Mfr_part_number: RC0402FR-07100RL; Part_type: RESISTORS\FIXED; Project: DLRU; Voltage: NA; Customs_HS_Code: 85332119; Custom_Duty: 15%; PCB Footprint: RES0402_0-5; Footprint Path: Y:\MIS_DATABASE\Library\ALTIUM_TOOL\PCB_FOOTPRINTS\Altium_Footprint_Lib.PcbLib; Library Path: Y:\MIS_DATABASE\Library\ALTIUM_TOOL\SCHEMATICS_PARTS\MS_DISCRETE_Library.schlib; Footprint Ref: RES0402_0-5; Library Ref: RESISTOR; Tolerance: 1%; Wattage: 1/16W; Package: 0402; Distributor_name: DIGIKEY; Distributor_part_number: 311-100LRCT-ND; Height: 0.40MM; Weight: 0.65mg; Temperature: -55°C+155°C; Datasheet: Y:\MIS_DATABASE\DATASHEETS\RESISTORS\RCXXXXL-SER_MAR18.PDF; Crtd /date: NAVEED/220714; Chkd/date: MANIRAJA/060318; MECHANICAL 3D STEP FILE: RES0402_0-5
R539 = RESISTOR_Dup6: as R160 on sheet 24; PCB Footprint: RES0201_0-5; MECHANICAL 3D STEP FILE: RES0201_0-5; Chkd/date: MANIRAJA/050517; Crtd /date: MANIRAJA/050517; Datasheet: Y:\MIS_DATABASE\DATASHEETS\RESISTORS\RCXXXXL-SER_MAR18.PDF; Temperature: -55°C+125°C; Weight: 0.17mg; Height: 0.26MM; Distributor_part_number: 311-10KNCT-ND; Distributor_name: DIGIKEY; Package: 0201; Wattage: 1/20W; Tolerance: 5%; Library Ref: RESISTOR; Footprint Ref: RES0201_0-5; Library Path: Y:\MIS_DATABASE\Library\ALTIUM_TOOL\SCHEMATICS_PARTS\MS_DISCRETE_Library.schlib; Footprint Path: Y:\MIS_DATABASE\Library\ALTIUM_TOOL\PCB_FOOTPRINTS\Altium_Footprint_Lib.PcbLib
R540 = RESISTOR_Dup1: RES 0E 1/20W 5% 0201; Part_type: RESISTORS\FIXED; Mfr_part_number: RC0201JR-070RL; Mfr_name: YAGEO AMERICA; Mistral Part No: 110010070067-R; Custom_Duty: 15%; Customs_HS_Code: 85332119; Voltage: NA; Project: PB_BUGBASE; PCB Footprint: RES0201_0-5; Footprint Path: Y:\MIS_DATABASE\Library\ALTIUM_TOOL\PCB_FOOTPRINTS\Altium_Footprint_Lib.PcbLib; Library Path: Y:\MIS_DATABASE\Library\ALTIUM_TOOL\SCHEMATICS_PARTS\MS_DISCRETE_Library.schlib; Footprint Ref: RES0201_0-5; Library Ref: RESISTOR; MECHANICAL 3D STEP FILE: RES0201_0-5; Chkd/date: NAVEED/301214; Crtd /date: MUDDU/120710; Datasheet: Y:\MIS_DATABASE\DATASHEETS\RESISTORS\RCXXXXL-SER_MAR18.PDF; Temperature: -55°C+125°C; Weight: 0.17mg; Height: 0.26MM; Distributor_part_number: 311-0.0NCT-ND; Distributor_name: DIGIKEY; Package: 0201; Wattage: 1/20W; Tolerance: 5%
R546 = RESISTOR_Dup6: as R162 on sheet 24; PCB Footprint: RES0201_0-5; Tolerance: 5%; Wattage: 1/20W; Package: 0201; Distributor_name: DIGIKEY; Distributor_part_number: 311-10KNCT-ND; Height: 0.26MM; Weight: 0.17mg; Temperature: -55°C+125°C; Datasheet: Y:\MIS_DATABASE\DATASHEETS\RESISTORS\RCXXXXL-SER_MAR18.PDF; Crtd /date: MANIRAJA/050517; Chkd/date: MANIRAJA/050517; MECHANICAL 3D STEP FILE: RES0201_0-5; Library Ref: RESISTOR; Footprint Ref: RES0201_0-5; Library Path: Y:\MIS_DATABASE\Library\ALTIUM_TOOL\SCHEMATICS_PARTS\MS_DISCRETE_Library.schlib; Footprint Path: Y:\MIS_DATABASE\Library\ALTIUM_TOOL\PCB_FOOTPRINTS\Altium_Footprint_Lib.PcbLib
R556 = RESISTOR_Dup4: as R527 on sheet 26; PCB Footprint: RES0402_0-5; Chkd/date: VASANTHA/281216; Crtd /date: MAZHAR/150506; Datasheet: Y:\MIS_DATABASE\DATASHEETS\RESISTORS\PAN-ERJSER_NOV17.PDF; Temperature: -55°C+155°C; Weight: 0.8mg; Height: 0.40MM; Distributor_part_number: P1.00KLCT-ND; Distributor_name: DIGIKEY; Package: 0402; Wattage: 1/10W; Tolerance: 1%; Library Ref: RESISTOR; Footprint Ref: RES0402_0-5; MECHANICAL 3D STEP FILE: RES0402_0-5; Library Path: Y:\MIS_DATABASE\Library\ALTIUM_TOOL\SCHEMATICS_PARTS\MS_DISCRETE_Library.schlib; Footprint Path: Y:\MIS_DATABASE\Library\ALTIUM_TOOL\PCB_FOOTPRINTS\Altium_Footprint_Lib.PcbLib
TP75 TP86 = TESTPOINT: as TP83 on sheet 26; PCB Footprint: TP20_SMD; RoHS: NA; Footprint Ref: TP20_SMD; Library Ref: TESTPOINT; Chkd/date: SHREESHAIL/171006; Crtd /date: MAZHAR/171006; Height: NA; Distributor_part_number: NA; Distributor_name: NA; Package: SMD; Part_type: TESTPOINT; Mfr_part_number: TP20_SMD; Tolerance: NA; Voltage: NA; Wattage: NA; Weight: NA; Temperature: NA; Datasheet: NA; MECHANICAL 3D STEP FILE: NA; Library Path: Y:\MIS_DATABASE\Library\ALTIUM_TOOL\SCHEMATICS_PARTS\MS_DISCRETE_Library.schlib; Footprint Path: Y:\MIS_DATABASE\Library\ALTIUM_TOOL\PCB_FOOTPRINTS\Altium_Footprint_Lib.PcbLib; Customs_HS_Code: NA; Custom_Duty: NA
TP76 = TESTPOINT: as TP74 on sheet 25; PCB Footprint: TP20_SMD; Footprint Path: Y:\MIS_DATABASE\Library\ALTIUM_TOOL\PCB_FOOTPRINTS\Altium_Footprint_Lib.PcbLib; Library Path: Y:\MIS_DATABASE\Library\ALTIUM_TOOL\SCHEMATICS_PARTS\MS_DISCRETE_Library.schlib; Datasheet: NA; Temperature: NA; Weight: NA; Wattage: NA; Voltage: NA; Tolerance: NA; Chkd/date: SHREESHAIL/171006; Crtd /date: MAZHAR/171006; Height: NA; Distributor_part_number: NA; Distributor_name: NA; Package: SMD; Part_type: TESTPOINT; Mfr_part_number: TP20_SMD; Mistral Part No: NA; Library Ref: TESTPOINT; Footprint Ref: TP20_SMD; RoHS: NA; Customs_HS_Code: NA; Custom_Duty: NA
TP77 TP79-TP82 = TESTPOINT: as TP73 on sheet 25; PCB Footprint: TP20_SMD; Customs_HS_Code: NA; Footprint Path: Y:\MIS_DATABASE\Library\ALTIUM_TOOL\PCB_FOOTPRINTS\Altium_Footprint_Lib.PcbLib; Library Path: Y:\MIS_DATABASE\Library\ALTIUM_TOOL\SCHEMATICS_PARTS\MS_DISCRETE_Library.schlib; MECHANICAL 3D STEP FILE: NA; Datasheet: NA; Temperature: NA; Weight: NA; Wattage: NA; Voltage: NA; Tolerance: NA; Mistral Part No: NA; Mfr_part_number: TP20_SMD; Part_type: TESTPOINT; Package: SMD; Distributor_name: NA; Distributor_part_number: NA; Height: NA; Crtd /date: MAZHAR/171006; Chkd/date: SHREESHAIL/171006; Library Ref: TESTPOINT; Footprint Ref: TP20_SMD; RoHS: NA
U45 = TM4C1294NCPDTT3R_TQFP128: IC 32-BIT MICROCONTROLLER WITH 1MB FLASH TQFP128; Mistral Part No: 141217080002-R; Mfr_name: TEXAS INSTRUMENTS; Part_type: ICS\DIGITAL\MICROCONTROLLER; Project: TI_MAXIE_CPB; Tolerance: NA; Customs_HS_Code: 85423100; Custom_Duty: 15%; PCB Footprint: TQFP128_15-74_550X550_1-2; Library Ref: TM4C1294NCPDTT3R_TQFP128; Mfr_part_number: TM4C1294NCPDTT3R; Voltage: NA; Wattage: NA; Package: TQF9128; Distributor_name: DIGIKEY; Distributor_part_number: TM4C1294NCPDTT3R-ND; Height: 1.20MM; Weight: 503.5mg; Temperature: -40°C+105°C; Datasheet: Y:\MIS_DATABASE\DATASHEETS\ICS\DIGITAL\MICROCONTROLLER\TM4C1294NCPD.PDF; Crtd /date: MANIRAJA/220817; Chkd/date: MANIRAJA/220817; MECHANICAL 3D STEP FILE: TQFP128_15-74_550X550_1-2
U47 = LM4040B25IDCKR_SC70-5: IC PRECISION MICROPOWER SHUNT VOLTAGE REFERENCE SC70-5; Mistral Part No: 142017080015-R; Mfr_name: TEXAS INSTRUMENTS; Part_type: ICS\POWER\VOLTAGE REGULATOR; Project: TI_MAXIE_CPB; Tolerance: NA; Customs_HS_Code: 85423100; Custom_Duty: 15%; PCB Footprint: SC70-5_1-1; Library Ref: LM4040B25IDCKR_SC70-5; Mfr_part_number: LM4040B25IDCKR; Voltage: NA; Wattage: NA; Package: SC70-5; Distributor_name: DIGIKEY; Distributor_part_number: 296-20873-1-ND; Height: 1.10MM; Weight: 30mg; Temperature: -40°C+85°C; Datasheet: Y:\MIS_DATABASE\DATASHEETS\ICS\POWER\LM4040B25I.PDF; Crtd /date: MANIRAJA/230817; Chkd/date: MANIRAJA/230817; MECHANICAL 3D STEP FILE: SC70-5_1-1
U79 = TPS79601DRBR_SON8: IC 1A HIGH PSRR RF ADJ LDO LINEAR REGULATOR SON8; Part_type: ICS\POWER\VOLTAGE REGULATOR; Mfr_name: TEXAS INSTRUMENTS; Mistral Part No: 142009080012-R; Custom_Duty: 15%; Customs_HS_Code: 85423100; Project: DIO_TXRX; Tolerance: NA; PCB Footprint: SON8_25-59_130X130_1; Footprint Ref: SON8_25-59_130X130_1; Library Ref: TPS79601DRBR_SON8; Chkd/date: MANIRAJA/030518; Crtd /date: MAZHAR/280809; Datasheet: Y:\MIS_DATABASE\DATASHEETS\MISC\REGULATORS\TPS796XX.PDF; Temperature: -40°C+125°C; Weight: 24mg; Height: 1.00MM; Distributor_part_number: 296-23107-1-ND; Distributor_name: DIGIKEY; Package: SON8; Mfr_part_number: TPS79601DRBR; Voltage: NA; Wattage: NA; MECHANICAL 3D STEP FILE: SON8_25-59_130X130_1; Library Path: Y:\MIS_DATABASE\Library\ALTIUM_TOOL\SCHEMATICS_PARTS\MS_MISCPOWER_Library.schlib; Footprint Path: Y:\MIS_DATABASE\Library\ALTIUM_TOOL\PCB_FOOTPRINTS\Altium_Footprint_Lib.PcbLib
U89 = TPD4E004_SON6: IC 4-CH ESD PROTECTION ARRAY FOR HIGH SPEED DATA INTERFACE SON6; Mistral Part No: 141010020012-R; Mfr_name: TEXAS INSTRUMENTS; Part_type: ICS\INTERFACE; Wattage: NA; Project: BUG_BASE-II; Customs_HS_Code: 85423100; Custom_Duty: 15%; PCB Footprint: SON6_19-68_40X60_PB_0-6; Footprint Path: Y:\MIS_DATABASE\Library\ALTIUM_TOOL\PCB_FOOTPRINTS\Altium_Footprint_Lib.PcbLib; Library Path: Y:\MIS_DATABASE\Library\ALTIUM_TOOL\SCHEMATICS_PARTS\MS_MISCINTERFACE_Library.schlib; MECHANICAL 3D STEP FILE: SON6_19-68_40X60_PB_0-6; Voltage: NA; Tolerance: NA; Footprint Ref: SON6_19-68_40X60_PB_0-6; Library Ref: TPD4E004_SON6; Mfr_part_number: TPD4E004DRYR; Package: SON6; Distributor_name: DIGIKEY; Distributor_part_number: 296-23618-1-ND; Height: 0.60MM; Weight: 3.2mg; Temperature: -40°C+85°C; Datasheet: Y:\MIS_DATABASE\DATASHEETS\ICS\INTERFACE\TPD4E004-SER.PDF; Crtd /date: MUDDU/010310; Chkd/date: MANIRAJA/100320
Y2 = CRY4_13: CRY 16.000MHz 8pF SMD; Mistral Part No: 130020100044-R; Mfr_name: MURATA; Mfr_part_number: XRCGB16M000FXN01R0; Part_type: CRYSTAL; Project: AM64X_SKEVM; Tolerance: NA; Customs_HS_Code: 85439000; Custom_Duty: 24%; PCB Footprint: XTAL4_XRCGB-FM_80X60_SMD_0-7; Footprint Ref: XTAL4_XRCGB-FM_80X60_SMD_0-7; Voltage: NA; Wattage: NA; Package: SMD; Distributor_name: DIGIKEY; Distributor_part_number: 490-18283-1-ND; Library Ref: CRY4_13; Height: 0.70MM; Weight: 195.4mg; Temperature: -30°C+85°C; Datasheet: Y:\MIS_DATABASE\DATASHEETS\MISC\CRY_OSC\XRCGB16M000FXN01R0.PDF; Crtd /date: ALVY/151020; Chkd/date: MANIRAJA/151020; MECHANICAL 3D STEP FILE: XTAL4_XRCGB-FM_80X60_SMD_0-7; Library Path: Y:\MIS_DATABASE\Library\ALTIUM_TOOL\SCHEMATICS_PARTS\MS_DISCRETE_Library.schlib; Footprint Path: Y:\MIS_DATABASE\Library\ALTIUM_TOOL\PCB_FOOTPRINTS\Altium_Footprint_Lib.PcbLib